# EAGLE design sld (EAGLE 6.4)
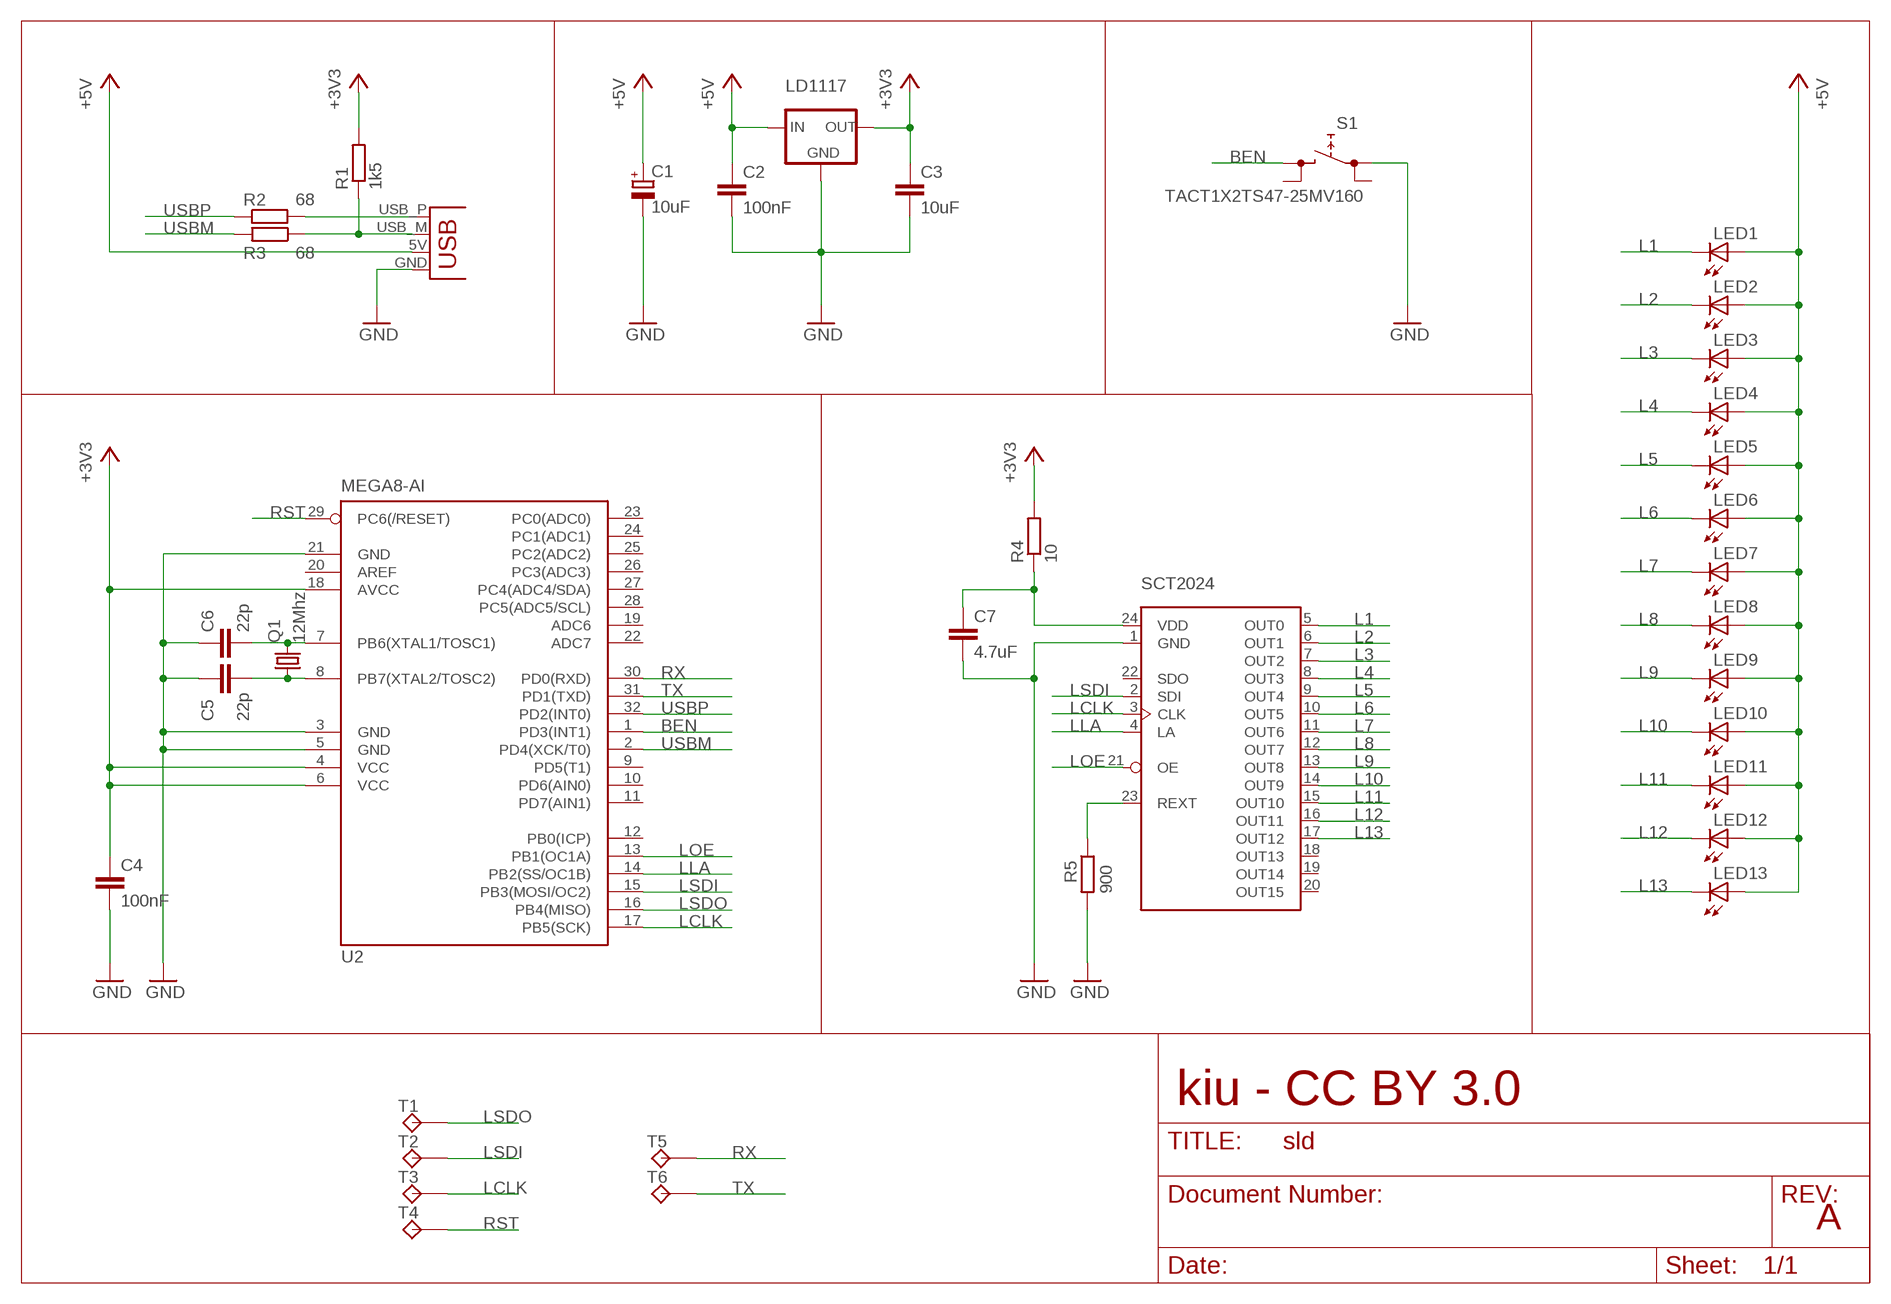
[diagram p0: schematic, sheet 1]

## Parts
C1  10uF  CPOL-EUCT3216  [CT3216]
C2  100nF  C-EUC0805  [C0805]
C3  10uF  C-EUC0805  [C0805]
C4  100nF  C-EUC0805  [C0805]
C5  22p  C-EUC0805  [C0805]
C6  22p  C-EUC0805  [C0805]
C7  4.7uF  C-EUC0805  [C0805]
JP1  USBPCB  [USB-A-PCB]
LED1  LEDKA-3528ASYC  [KA-3528ASYC]
LED2  LEDKA-3528ASYC  [KA-3528ASYC]
LED3  LEDKA-3528ASYC  [KA-3528ASYC]
LED4  LEDKA-3528ASYC  [KA-3528ASYC]
LED5  LEDKA-3528ASYC  [KA-3528ASYC]
LED6  LEDKA-3528ASYC  [KA-3528ASYC]
LED7  LEDKA-3528ASYC  [KA-3528ASYC]
LED8  LEDKA-3528ASYC  [KA-3528ASYC]
LED9  LEDKA-3528ASYC  [KA-3528ASYC]
LED10  LEDKA-3528ASYC  [KA-3528ASYC]
LED11  LEDKA-3528ASYC  [KA-3528ASYC]
LED12  LEDKA-3528ASYC  [KA-3528ASYC]
LED13  LEDKA-3528ASYC  [KA-3528ASYC]
Q1  12Mhz  CRYSTALHC49UP  [HC49UP]
R1  1k5  R-EU_R0805  [R0805]
R2  68  R-EU_R0805  [R0805]
R3  68  R-EU_R0805  [R0805]
R4  10  R-EU_R0805  [R0805]
R5  900  R-EU_R0805  [R0805]
S1  TACT1X2TS47-25MV160  [TACT1.7X5.15]
T1  PAD  [PAD-1X1]
T2  PAD  [PAD-1X1]
T3  PAD  [PAD-1X1]
T4  PAD  [PAD-1X1]
T5  PAD  [PAD-1X1]
T6  PAD  [PAD-1X1]
U1  LD1117  [SOT223]
U2  MEGA8-AI  [TQFP32-08]
U3  SCT2024  [SSOP24]

## Nets
+3V3: C3.1 C4.1 R1.2 R4.2 U1.2(OUT) U2.4(VCC) U2.6(VCC) U2.18(AVCC)
+5V: C1.+ C2.1 JP1.5V(VBUS) LED1.A LED2.A LED3.A LED4.A LED5.A LED6.A LED7.A LED8.A LED9.A LED10.A LED11.A LED12.A LED13.A U1.3(IN)
BEN: S1.2 U2.1(PD3(INT1))
GND: C1.- C2.2 C3.2 C4.2 C5.1 C6.1 C7.2 JP1.GND R5.2 S1.1 U1.1(GND) U2.3(GND) U2.5(GND) U2.21(GND) U3.1(GND)
L1: LED1.C U3.5(OUT0)
L2: LED2.C U3.6(OUT1)
L3: LED3.C U3.7(OUT2)
L4: LED4.C U3.8(OUT3)
L5: LED5.C U3.9(OUT4)
L6: LED6.C U3.10(OUT5)
L7: LED7.C U3.11(OUT6)
L8: LED8.C U3.12(OUT7)
L9: LED9.C U3.13(OUT8)
L10: LED10.C U3.14(OUT9)
L11: LED11.C U3.15(OUT10)
L12: LED12.C U3.16(OUT11)
L13: LED13.C U3.17(OUT12)
LCLK: T3.P1 U2.17(PB5(SCK)) U3.3(CLK)
LLA: U2.14(PB2(SS/OC1B)) U3.4(LA)
LOE: U2.13(PB1(OC1A)) U3.21(OE)
LSDI: T2.P1 U2.15(PB3(MOSI/OC2)) U3.2(SDI)
LSDO: T1.P1 U2.16(PB4(MISO))
N$1: C6.2 Q1.2 U2.7(PB6(XTAL1/TOSC1))
N$2: C5.2 Q1.1 U2.8(PB7(XTAL2/TOSC2))
N$3: R5.1 U3.23(REXT)
N$4: C7.1 R4.1 U3.24(VDD)
N$25: JP1.USB_P(D+) R2.2
N$26: JP1.USB_M(D-) R1.1 R3.1
RST: T4.P1 U2.29(PC6(/RESET))
RX: T5.P1 U2.30(PD0(RXD))
TX: T6.P1 U2.31(PD1(TXD))
USBM: R3.2 U2.2(PD4(XCK/T0))
USBP: R2.1 U2.32(PD2(INT0))
Unconnected: S1.3 S1.4 U2.9(PD5(T1)) U2.10(PD6(AIN0)) U2.11(PD7(AIN1)) U2.12(PB0(ICP)) U2.19(ADC6) U2.20(AREF) U2.22(ADC7) U2.23(PC0(ADC0)) U2.24(PC1(ADC1)) U2.25(PC2(ADC2)) U2.26(PC3(ADC3)) U2.27(PC4(ADC4/SDA)) U2.28(PC5(ADC5/SCL)) U3.18(OUT13) U3.19(OUT14) U3.20(OUT15) U3.22(SDO)

## Notes on the sheet
- kiu - CC BY 3.0
- A

## Library data of the parts
C1 = rcl:CPOL-EU: POLARIZED CAPACITOR, European symbol
C2-C7 = rcl:C-EU: CAPACITOR, European symbol
JP1 = SparkFun-Connectors:USB: USB Connectors USB-B-PTH is fully proven SKU : PRT-00139/CONN-08278 USB-miniB is fully proven SKU : PRT-00587 USB-A-PCB is untested. USB-A-H is throughly reviewed, but untested. Spark Fun Electronics SKU : PRT-00437 USB-B-SMT is throughly reviewed, but untested. Needs silkscreen touching up. USB-A-S has not been used/tested USB-MB-H has not been used/tested USB-MICROB has been used. CONN-09505
LED1-LED13 = led:LED: LED OSRAM: - CHIPLED LG R971, LG N971, LY N971, LG Q971, LY Q971, LO R971, LY R971 LH N974, LH R974 LS Q976, LO Q976, LY Q976 LO Q996 - Hyper CHIPLED LW Q18S LB Q993, LB Q99A, LB R99A - SideLED LS A670, LO A670, LY A670, LG A670, LP A670 LB A673, LV A673, LT A673, LW A673 LH A674 LY A675 LS A676, LA A676, LO A676, LY A676, LW A676 LS A679, LY A679, LG A679 - Hyper Micro SIDELED® LS Y876, LA Y876, LO Y876, LY Y876 LT Y87S - SmartLED LW L88C, LW L88S LB L89C, LB L89S, LG L890 LS L89K, LO L89K, LY L89K LS L896, LA L896, LO L896, LY L896 - TOPLED LS T670, LO T670, LY T670, LG T670, LP T670 LSG T670, LSP T670, LSY T670, LOP T670, LYG T670 LG T671, LOG T671, LSG T671 LB T673, LV T673, LT T673, LW T673 LH T674 LS T676, LA T676, LO T676, LY T676, LB T676, LH T676, LSB T676, LW T676 LB T67C, LV T67C, LT T67C, LS T67K, LO T67K, LY T67K, LW E67C LS E67B, LA E67B, LO E67B, LY E67B, LB E67C, LV E67C, LT E67C LW T67C LS T679, LY T679, LG T679 LS T770, LO T770, LY T770, LG T770, LP T770 LB T773, LV T773, LT T773, LW T773 LH T774 LS E675, LA E675, LY E675, LS T675 LS T776, LA T776, LO T776, LY T776, LB T776 LHGB T686 LT T68C, LB T68C - Hyper Mini TOPLED® LB M676 - Mini TOPLED Santana® LG M470 LS M47K, LO M47K, LY M47K Source: http://www.osram.convergy.de LUXEON: - LUMILED® LXK2-PW12-R00, LXK2-PW12-S00, LXK2-PW14-U00, LXK2-PW14-V00 LXK2-PM12-R00, LXK2-PM12-S00, LXK2-PM14-U00 LXK2-PE12-Q00, LXK2-PE12-R00, LXK2-PE12-S00, LXK2-PE14-T00, LXK2-PE14-U00 LXK2-PB12-K00, LXK2-PB12-L00, LXK2-PB12-M00, LXK2-PB14-N00, LXK2-PB14-P00, LXK2-PB14-Q00 LXK2-PR12-L00, LXK2-PR12-M00, LXK2-PR14-Q00, LXK2-PR14-R00 LXK2-PD12-Q00, LXK2-PD12-R00, LXK2-PD12-S00 LXK2-PH12-R00, LXK2-PH12-S00 LXK2-PL12-P00, LXK2-PL12-Q00, LXK2-PL12-R00 Source: www.luxeon.com KINGBRIGHT: KA-3528ASYC Source: www.kingbright.com
Q1 = crystal:CRYSTAL: CRYSTAL; OC_FARNELL: unknown; OC_NEWARK: unknown
R1-R5 = rcl:R-EU_: RESISTOR, European symbol
S1 = kiu:TACT1X2
T1-T6 = kiu:PAD
U1 = kiu:LD1117
U2 = atmel:MEGA8: MICROCONTROLLER 8 Kbytes FLASH, 1 kbytes SRAM, 512 bytes EEPROM, USART, 6-channel 10 bit ADC, 2-channel 8 bit ADC Pin compatible with Atmega48, ATMega88, ATMega168 Source: avr.lbr; MPN: ATMEGA8-16AU; OC_FARNELL: 9171371; OC_NEWARK: 73M8863
U3 = kiu:SCT2024

## Board
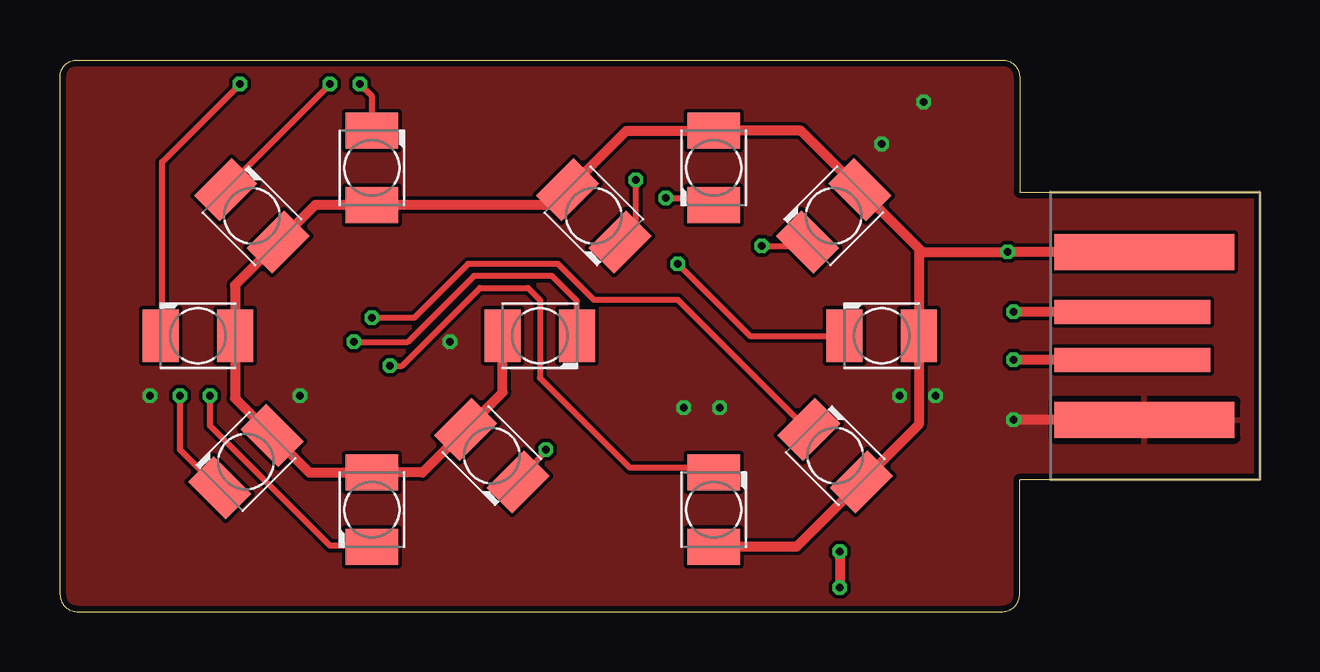
[diagram p1: board, top side]
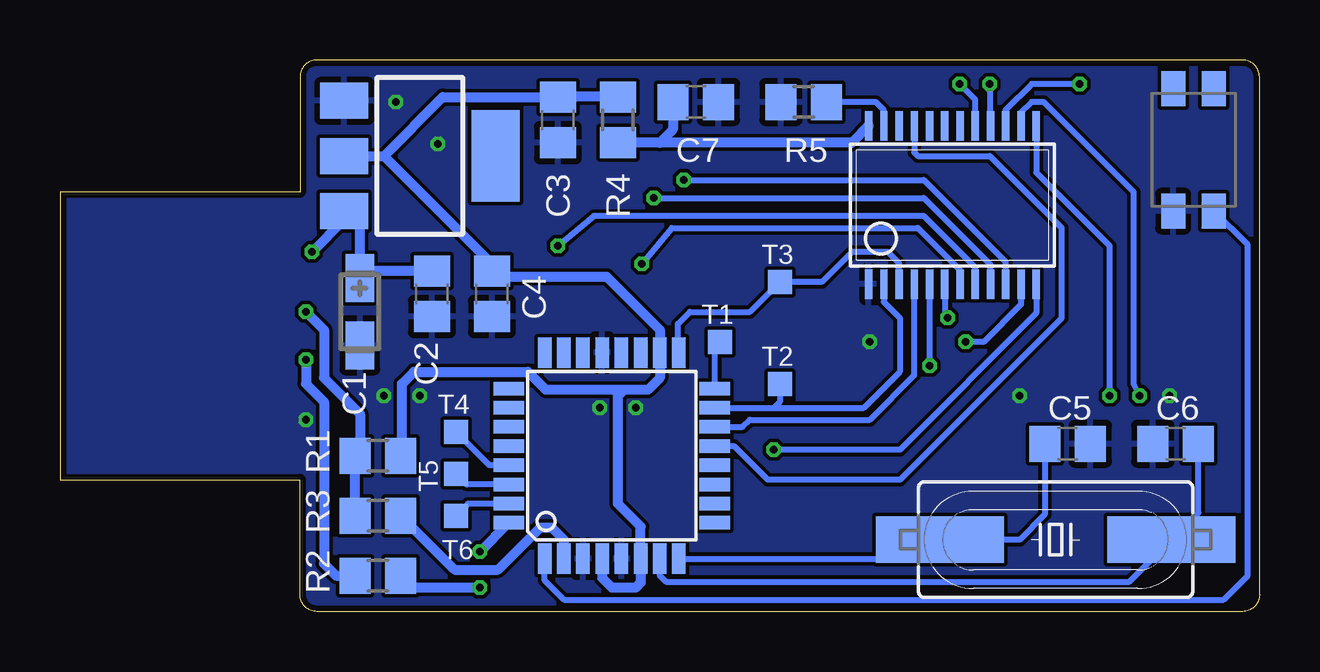
[diagram p2: board, bottom side, seen from below]

Size 50 x 23 mm. Coordinates in mm from the lower left corner, seen from the top.
Outline: 0,0.71 0,22.29 arc-90 0.71,23 39.29,23 arc-90 40,22.29 40,17.5 50,17.5 50,5.5 40,5.5 40,0.71 arc-90 39.29,0 0.71,0 arc-90 0,0.71
Copper layers (1*2*15*16): Top 0.035mm / dielectric 0.2mm / layer 2 0.0175mm / dielectric 1.1mm / layer 15 0.0175mm / dielectric 0.2mm / Bottom 0.035mm
Design rules "SeeedStudio_DRU_no_angle_20130527": minimum track width 6mil, minimum drill 12mil, track to track 6mil, track to pad 6mil, pad to pad 6mil, via to via 6mil, smd to smd 0mil, copper to edge 10mil, drill to drill 10mil, minimum pad ring 6mil, minimum via ring 6mil, stop-mask expansion 2mil, vias tented up to drill 25mil, thermal gap 10mil

### Footprints (pad centres in the part's own frame; a part is rotated, then mirrored left to right if it is on the bottom)
CT3216 = smd 2 x 1.2: + -1.4,0; - 1.4,0
C0805 = smd 1.3 x 1.5: 1 -0.95,0; 2 0.95,0
USB-A-PCB = smd 7.5 x 1.5: 5V -0.2,-3.5; GND -0.2,3.5 | smd 6.5 x 1: USB_M 0.3,-1; USB_P 0.3,1
KA-3528ASYC = smd 1.5 x 2.2: A -1.55,0; C 1.55,0
HC49UP = smd 5.334 x 1.93: 1 -4.826,0; 2 4.826,0
R0805 = smd 1.3 x 1.5: 1 -0.95,0; 2 0.95,0
TACT1.7X5.15 = smd 1.45 x 1: 1 -2.55,0.85; 2 -2.55,-0.85; 3 2.55,0.85; 4 2.55,-0.85
PAD-1X1 = smd 1 x 1: P1 0,0
SOT223 = smd 1.5 x 2: 1 -2.3,-3.15; 2 0,-3.15; 3 2.3,-3.15 | smd 3.8 x 2: 4 0,3.15
TQFP32-08 = smd 1.27 x 0.559: 1 -4.293,2.8; 2 -4.293,2; 3 -4.293,1.2; 4 -4.293,0.4; 5 -4.293,-0.4; 6 -4.293,-1.2; 7 -4.293,-2; 8 -4.293,-2.8; 17 4.293,-2.8; 18 4.293,-2; 19 4.293,-1.2; 20 4.293,-0.4; 21 4.293,0.4; 22 4.293,1.2; 23 4.293,2; 24 4.293,2.8 | smd 0.559 x 1.27: 9 -2.8,-4.293; 10 -2,-4.293; 11 -1.2,-4.293; 12 -0.4,-4.293; 13 0.4,-4.293; 14 1.2,-4.293; 15 2,-4.293; 16 2.8,-4.293; 25 2.8,4.293; 26 2,4.293; 27 1.2,4.293; 28 0.4,4.293; 29 -0.4,4.293; 30 -1.2,4.293; 31 -2,4.293; 32 -2.8,4.293
SSOP24 = smd 0.305 x 1.245: 1 -2.794,-3.353; 2 -2.159,-3.353; 3 -1.524,-3.353; 4 -0.889,-3.353; 5 -0.254,-3.353; 6 0.381,-3.353; 7 1.016,-3.353; 8 1.651,-3.353; 9 2.286,-3.353; 10 2.921,-3.353; 11 3.556,-3.353; 12 4.191,-3.353; 13 4.191,3.251; 14 3.556,3.251; 15 2.921,3.251; 16 2.286,3.251; 17 1.651,3.251; 18 1.016,3.251; 19 0.381,3.251; 20 -0.254,3.251; 21 -0.889,3.251; 22 -1.524,3.251; 23 -2.159,3.251; 24 -2.794,3.251

### Placement (x,y rotation side)
C1  37.5,12.5 270 bottom
C2  34.5,13.25 270 bottom
C3  29.25,20.5 270 bottom
C4  32,13.25 270 bottom
C5  8,7 180 bottom
C6  3.5,7 0 bottom
C7  23.5,21.25 0 bottom
JP1  45,11.5 180 top
LED1  27.25,4.25 90 top
LED2  32.32,6.5 135 top
LED3  34.25,11.5 180 top
LED4  32.25,16.5 225 top
LED5  27.25,18.5 270 top
LED6  22.25,16.5 315 top
LED7  20,11.5 0 top
LED8  18,6.5 315 top
LED9  13,4.25 270 top
LED10  7.75,6.25 225 top
LED11  5.75,11.5 180 top
LED12  8,16.5 135 top
LED13  13,18.5 90 top
Q1  8.5,3 0 bottom
R1  36.75,6.5 0 bottom
R2  36.75,1.5 180 bottom
R3  36.75,4 0 bottom
R4  26.75,20.5 90 bottom
R5  19,21.25 180 bottom
S1  2.75,19.25 90 bottom
T1  22.5,11.25 0 bottom
T2  20,9.5 0 bottom
T3  20,13.75 0 bottom
T4  33.5,7.5 0 bottom
T5  33.5,5.75 0 bottom
T6  33.5,4 0 bottom
U1  35,19 270 bottom
U2  27,6.5 90 bottom
U3  13.5,17 0 bottom

### Tracks (layer width: path | path; a pad name or v marks a point on that pad's centre or on a via)
+3V3
  Bottom 0.406: U1.2 36.5,19 | 36.5,19 34.05,21.45 C3.1 29.45,21.5 27.05,21.5 R4.2 | U2.4 27.4,1.4 27,1 26,1 25.8,1.2 U2.6 25.8,3.55 26.75,4.5 26.75,9 26.5,9.25 | 36.5,19 31.95,14.45 C4.1 31.75,13.95 27.2,13.95 25,11.75 U2.18 25,9.75 25.5,9.25 26.5,9.25 | 26.5,9.25 29.75,9.25 30.5,10 35.25,10 35.75,9.5 35.75,6.8 35.5,6.55 R1.2
+5V  (via drill 0.3)
  Top 0.406: JP1.5V v39.5,15 35.94,15 35.8,15.14 | 35.8,15.14 LED4.A 30.89,20.05 LED5.A 23.61,20.05 LED6.A 20.51,16.95 LED13.A 10.64,16.95 LED12.A 7.3,13.61 LED11.A 7.3,8.89 LED10.A 10.39,5.8 LED9.A 15.11,5.8 LED8.A 18.45,9.14 LED7.A | 35.8,15.14 LED3.A 35.8,7.79 LED2.A 30.71,2.7 LED1.A
  Bottom 0.406: C2.1 36.95,14.2 C1.+ 37.5,16.05 U1.3 38.15,16.35 v39.5,15
BEN
  Bottom 0.254: U2.1 29.8,1.3 29,0.5 1.5,0.5 0.5,1.5 0.5,15.3 S1.2
GND  (via drill 0.3)
  Top 0.406: JP1.GND v39.75,8
  other vias: 36,21.25 16.25,11.25 36.5,9 27.5,8.5 10,9 35,9 34.25,19.5 3.75,9 26,8.5
  pour Top: -0.5,23.5 40.5,23.5 40.5,18 50.5,18 50.5,5 40.5,5 40.5,-0.5 -0.5,-0.5
  pour Bottom: -0.5,23.5 40.5,23.5 40.5,18 50.5,18 50.5,5 40.5,5 40.5,-0.5 -0.5,-0.5
L1  (via drill 0.3)
  Top 0.254: LED1.C 27.25,6 23.75,6 20,9.75 20,13 19.5,13.5 17.5,13.5 14.25,10.25 v13.75,10.25
  Bottom 0.254: v13.75,10.25 13.75,13.5 U3.5
L2  (via drill 0.3)
  Top 0.254: v13,12.25 14.75,12.25 17,14.5 20.75,14.5 22.25,13 25.75,13 31,7.75 LED2.C
  Bottom 0.254: U3.6 13.12,12.37 v13,12.25
L3  (via drill 0.3)
  Top 0.254: 32.5,11.5 LED3.C 28.75,11.5 v25.75,14.5
  Bottom 0.254: U3.7 12.48,14.23 14.25,16 24.5,16 v25.75,14.5
L4  (via drill 0.3)
  Top 0.254: 31,15.5 LED4.C 30.81,15.25 v29.25,15.25
  Bottom 0.254: U3.8 11.85,14.35 14,16.5 27.75,16.5 v29.25,15.25
L5  (via drill 0.3)
  Top 0.254: 27.25,16.75 LED5.C 26.95,17.25 v25.25,17.25
  Bottom 0.254: v25.25,17.25 14,17.25 11.21,14.46 U3.9
L6  (via drill 0.3)
  Top 0.254: LED6.C 23.25,15.5 24,16.25 v24,18
  Bottom 0.254: v24,18 14,18 10.58,14.58 U3.10
L7  (via drill 0.3)
  Top 0.254: LED7.C 21.55,12.95 20.5,14 17.25,14 14.5,11.25 v12.25,11.25
  Bottom 0.254: v12.25,11.25 11.5,11.25 9.94,12.81 U3.11
L8  (via drill 0.3)
  Top 0.254: v20.25,6.75 19,5.25 LED8.C
  Bottom 0.254: U3.12 9.31,12.44 15,6.75 v20.25,6.75
L9  (via drill 0.3)
  Top 0.254: LED9.C 13,2.75 11.25,2.75 6.25,7.75 v6.25,9
  Bottom 0.254: U3.13 9.31,18.31 6.25,15.25 v6.25,9
L10  (via drill 0.3)
  Top 0.254: v5,9 5,6.75 6.5,5.25 LED10.C
  Bottom 0.254: U3.14 9.94,20.81 9.5,21.25 9,21.25 5.25,17.5 5.25,9.5 v5,9
L11  (via drill 0.3)
  Top 0.254: LED11.C 4.25,11.5 4.25,18.75 v7.5,22
  Bottom 0.254: U3.15 10.58,20.92 9.5,22 v7.5,22
L12  (via drill 0.3)
  Top 0.254: v11.25,22 7,17.75 LED12.C
  Bottom 0.254: U3.16 11.21,21.96 v11.25,22
L13  (via drill 0.3)
  Top 0.254: v12.5,22 13,21.5 LED13.C
  Bottom 0.254: U3.17 11.85,21.35 v12.5,22
LCLK
  Bottom 0.254: U3.3 15.02,14.52 15.5,15 17,15 18.25,13.75 T3.P1 21.25,12.5 23.75,12.5 24.25,12 24.25,10.84 U2.17
LLA
  Bottom 0.254: U3.4 14.39,9.86 16.25,8 21.25,8 21.55,7.7 U2.14
LOE
  Bottom 0.254: U3.21 14.39,19.14 14.25,19 11.25,19 8.25,16 8.25,12.25 15,5.5 20.5,5.5 21.9,6.9 U2.13
LSDI
  Bottom 0.254: U2.15 20.25,8.5 | 20.25,8.5 16.5,8.5 15,10 15,12.25 15.66,12.91 U3.2 | T2.P1 20,8.75 20.25,8.5
LSDO
  Bottom 0.254: U2.16 22.71,11.04 T1.P1
N$1
  Bottom 0.254: C6.2 2.55,4.12 Q1.2 5.42,1.25 24.75,1.25 25,1.5 U2.7
N$2
  Bottom 0.254: 12.95,3 Q1.1 | Q1.1 14.12,2.21 U2.8 | C5.2 8.95,4.05 10,3 Q1.1
N$3
  Bottom 0.254: U3.23 15.66,20.91 16,21.25 R5.1
N$4
  Bottom 0.406: 26.55,20 R4.1 | 26.7,19.25 R4.1 | U3.24 17,19.55 25,19.55 | 25,19.55 R4.1 | C7.1 24.45,20.1 25,19.55
N$25  (via drill 0.3)
  Top 0.406: JP1.USB_P v39.75,10.5
  Bottom 0.406: v39.75,10.5 39.75,9.5 39,8.75 39,2 38.5,1.5 R2.2
N$26  (via drill 0.3)
  Top 0.406: JP1.USB_M v39.75,12.5
  Bottom 0.406: R3.1 R1.1 37.5,6.55 37.5,8.25 39,9.75 39,11.75 v39.75,12.5
RST
  Bottom 0.254: U2.29 32.1,6.1 T4.P1
RX
  Bottom 0.254: U2.30 33.05,5.3 T5.P1
TX
  Bottom 0.254: U2.31 33,4.5 T6.P1
USBM
  Bottom 0.406: U2.2 29,3 29.5,3.5 30,3.5 31.75,1.75 33.55,1.75 R3.2 35.55,3.8
USBP  (via drill 0.3)
  Top 0.406: v32.5,2.5 v32.5,1
  Bottom 0.406: v32.5,2.5 U2.32 | v32.5,1 35.3,1 R2.1

### Text on the board
bDocu: kiu | SLD REV A | http://github.com/kiu/sld